# EAGLE design LAMPU_EMERGENCY_v1.0 (EAGLE 9.6.1)
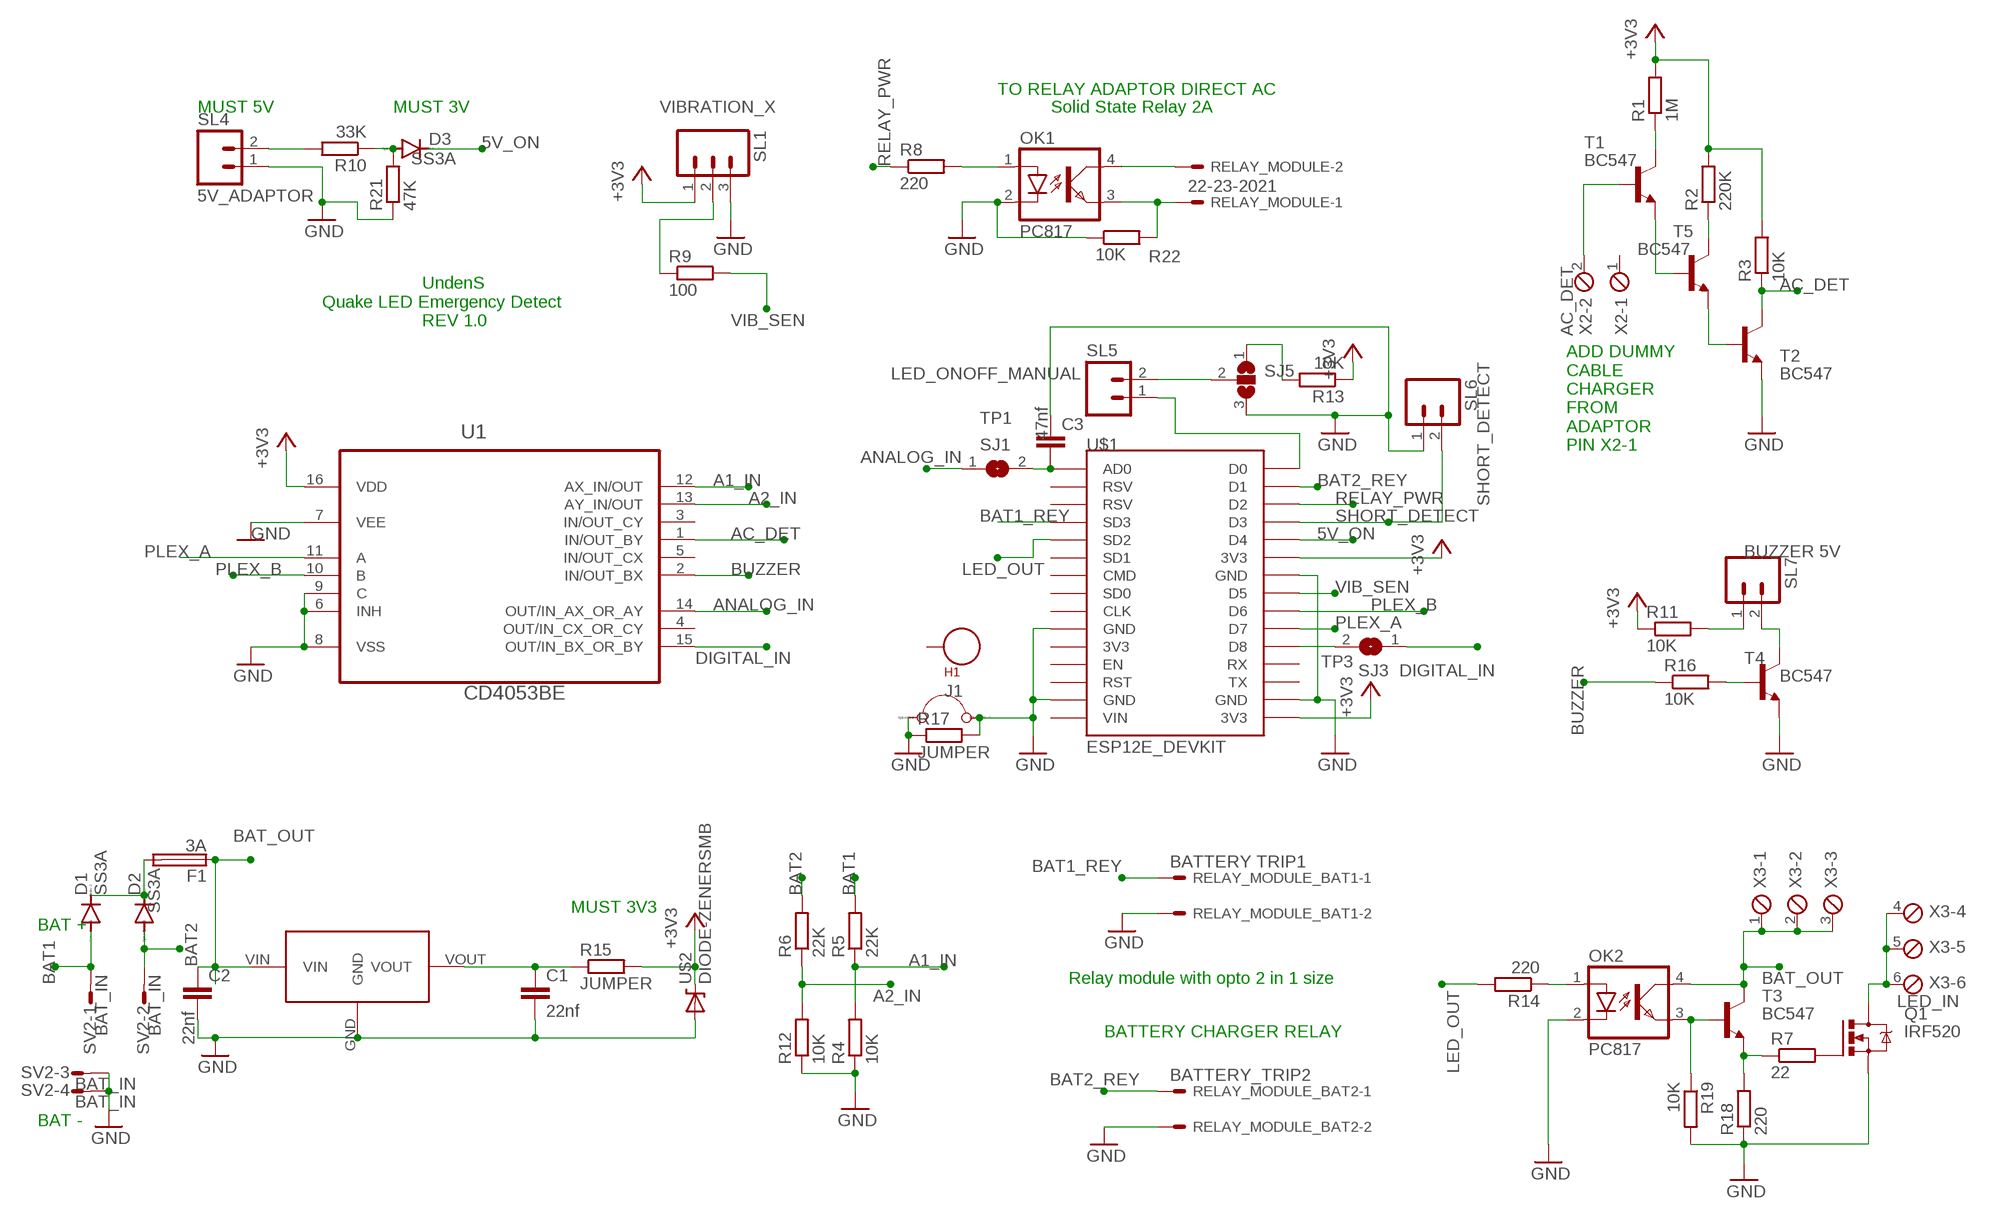
[diagram p0: schematic, sheet 1]

## Parts
C1  22nf  C-EUC0805K  [C0805K]
C2  22nf  C-EUC0805K  [C0805K]
C3  47nf  C-EUC0805K  [C0805K]
D1  SS3A  ES2D  [SMB]
D2  SS3A  ES2D  [SMB]
D3  SS3A  ES2D  [SMB]
F1  3A  FUSEGSH15  [GSH15]
H1  SEW_HOLE  [SIMPLE_HOLE]
J1  JUMPER  [05]
OK1  PC817  [DIL04]
OK2  PC817  [DIL04]
Q1  IRF520  [TO220BV]
R1  1M  R-EU_0207/7  [0207/7]
R2  220K  R-EU_0207/7  [0207/7]
R3  10K  R-EU_0207/7  [0207/7]
R4  10K  R-EU_0207/7  [0207/7]
R5  22K  R-EU_0207/7  [0207/7]
R6  22K  R-EU_0207/7  [0207/7]
R7  22  R-EU_0207/7  [0207/7]
R8  220  R-EU_0207/7  [0207/7]
R9  100  R-EU_0207/7  [0207/7]
R10  33K  R-EU_0207/7  [0207/7]
R11  10K  R-EU_0207/7  [0207/7]
R12  10K  R-EU_0207/7  [0207/7]
R13  10K  R-EU_0207/7  [0207/7]
R14  220  R-EU_0207/7  [0207/7]
R15  JUMPER  R-EU_0207/15  [0207/15]
R16  10K  R-EU_0207/7  [0207/7]
R17  JUMPER  R-EU_0207/7  [0207/7]
R18  220  R-EU_0207/7  [0207/7]
R19  10K  R-EU_0207/7  [0207/7]
R21  47K  R-EU_0207/7  [0207/7]
R22  10K  R-EU_0207/7  [0207/7]
RELAY_MODULE  22-23-2021  [22-23-2021]
RELAY_MODULE_BAT1  BATTERY TRIP1  22-23-2021  [22-23-2021]
RELAY_MODULE_BAT2  BATTERY_TRIP2  22-23-2021  [22-23-2021]
SJ1  TP1  SJW  [SJW]
SJ3  TP3  SJW  [SJW]
SJ5  SJ2WW  [SJ_2W]
SL1  VIBRATION_X  M03  [03P]
SL4  5V_ADAPTOR  M02  [02P]
SL5  LED_ONOFF_MANUAL  M02  [02P]
SL6  SHORT_DETECT  M02  [02P]
SL7  BUZZER 5V  M02  [02P]
SV2  BAT_IN  S04P  [S04P]
T1  BC547  [TO92]
T2  BC547  [TO92]
T3  BC547  [TO92]
T4  BC547  [TO92]
T5  BC547  [TO92]
U1  CD4053BE  [DIP254P762X508-16]
U$1  ESP12E_DEVKIT  [ESP12E_DEVKIT]
U$2  DIODE-ZENERSMB  [SMB-DIODE]
U$3  HT7333  [SOT89]
X2  AC_DET  MPT2  [2POL254]
X3  LED_IN  MPT6  [6POL254]

## Nets
5V_ON: D3.C U$1.D4
+3V3: R1.2 R2.2 R3.2 R11.1 R13.1 R15.2 SL1.1 U1.16(VDD) U$1.3V3@1(3V3) U$1.3V3@2(3V3) U$2.C
A1_IN: R4.2 R5.1 U1.12(AX_IN/OUT)
A2_IN: R6.1 R12.2 U1.13(AY_IN/OUT)
AC_DET: R3.1 T2.3(C) U1.1(IN/OUT_BY)
ANALOG_IN: SJ1.1 U1.14(OUT/IN_AX_OR_AY)
BAT1: D1.A R5.2 SV2.1
BAT1_REY: RELAY_MODULE_BAT1.1 U$1.SD3
BAT2: D2.A R6.2 SV2.2
BAT2_REY: RELAY_MODULE_BAT2.1 U$1.D1
BAT_OUT: C2.1 F1.1 OK2.4(COL) T3.3(C) U$3.VIN X3.1 X3.2 X3.3
BUZZER: R16.1 U1.2(IN/OUT_BX)
DIGITAL_IN: SJ3.1 U1.15(OUT/IN_BX_OR_BY)
GND: C1.2 C2.2 C3.1 J1.1(+) J1.2(-) OK1.2(C) OK2.2(C) Q1.S R4.1 R12.1 R17.1 R17.2 R18.1 R19.2 R21.1 R22.1 RELAY_MODULE_BAT1.2 RELAY_MODULE_BAT2.2 SJ5.3 SL1.3 SL4.1 SL6.1 SV2.3 SV2.4 T2.1(E) T4.1(E) U1.6(INH) U1.7(VEE) U1.8(VSS) U1.9(C) U$1.GND@0(GND) U$1.GND@1(GND) U$1.GND@2(GND) U$1.GND@3(GND) U$2.A U$3.GND
LED_OUT: R14.2 U$1.SD2
N$1: SJ3.2 U$1.D8
N$2: R1.1 T1.3(C)
N$3: T1.1(E) T5.2(B)
N$4: R2.1 T5.3(C)
N$5: T2.2(B) T5.1(E)
N$6: T1.2(B) X2.2
N$7: R13.2 SJ5.1
N$8: OK1.1(A) R8.2
N$9: OK1.4(COL) RELAY_MODULE.2
N$10: OK1.3(EMIT) R22.2 RELAY_MODULE.1
N$11: C3.2 SJ1.2 U$1.AD0
N$12: R11.2 SL7.1
N$13: R9.1 SL1.2
N$15: SL7.2 T4.3(C)
N$16: D3.A R10.1 R21.2
N$17: D1.C D2.C F1.2
N$18: R16.2 T4.2(B)
N$19: SL5.1 U$1.D0
N$20: OK2.3(EMIT) R19.1 T3.2(B)
N$21: R7.1 R18.2 T3.1(E)
N$22: Q1.G R7.2
N$23: OK2.1(A) R14.1
N$24: Q1.D X3.4 X3.5 X3.6
N$25: R10.2 SL4.2
N$26: C1.1 R15.1 U$3.VOUT
N$27: SJ5.2 SL5.2
PLEX_A: U1.11(A) U$1.D7
PLEX_B: U1.10(B) U$1.D6
RELAY_PWR: R8.1 U$1.D2
SHORT_DETECT: SL6.2 U$1.D3
VIB_SEN: R9.2 U$1.D5
Unconnected: H1.P$1 U1.3(IN/OUT_CY) U1.4(OUT/IN_CX_OR_CY) U1.5(IN/OUT_CX) U$1.3V3@0(3V3) U$1.CLK U$1.CMD U$1.EN U$1.RST U$1.RSV@0(RSV) U$1.RSV@1(RSV) U$1.RX U$1.SD0 U$1.SD1 U$1.TX U$1.VIN X2.1

## Notes on the sheet
- TO RELAY ADAPTOR DIRECT AC
- MUST 5V | MUST 3V | Solid State Relay 2A
- UndenS
  Quake LED Emergency Detect
                      REV 1.0
- ADD DUMMY
  CABLE
  CHARGER
  FROM
  ADAPTOR
  PIN X2-1
- MUST 3V3
- BAT +
- Relay module with opto 2 in 1 size
- BATTERY CHARGER RELAY
- BAT -

## Library data of the parts
C1-C3 = rcl:C-EU: CAPACITOR, European symbol; SPICEPREFIX: C
D1-D3 = diode:ES2D: DIODE super fast rectifier, 2 A
F1 = fuse:FUSE: Fuse; OC_FARNELL: unknown; OC_NEWARK: unknown
H1 = LilyPad-Wearables:SEW_HOLE: Simple sew-hole .1" diameter hole with 20mil annular ring
J1 = Misc:JUMPER: A wire jumper. This component lets you give the same net two different names
OK1 = optocoupler:PC817: SHARP OPTO COUPLER; MPN: PC817X4J000F; OC_FARNELL: 9707727; OC_NEWARK: 97K7059
OK2 = optocoupler:PC817: SHARP OPTO COUPLER; MPN: PC817X4J000F; OC_FARNELL: 9707727; OC_NEWARK: 97K7059; SPICEPREFIX: O
Q1 = transistor-power:IRF520: HEXFET Power MOSFET; SPICEPREFIX: Q
R1-R14 R16-R19 R21 R22 = rcl:R-EU_: RESISTOR, European symbol; SPICEPREFIX: R
R15 = resistor:R-EU_: RESISTOR, European symbol
RELAY_MODULE RELAY_MODULE_BAT1 RELAY_MODULE_BAT2 = con-molex:22-23-2021: .100" (2.54mm) Center Header - 2 Pin; MF: MOLEX; MPN: 22-23-2021; OC_FARNELL: 1462926; OC_NEWARK: 25C3832
SJ1 SJ3 = jumper:SJ: SMD solder JUMPER
SJ5 = jumper:SJ2W: SMD solder JUMPER
SL1 = con-amp-quick:M03: AMP QUICK CONNECTOR; OC_FARNELL: unknown; OC_NEWARK: unknown
SL4-SL7 = con-amp-quick:M02: AMP QUICK CONNECTOR; OC_FARNELL: unknown; OC_NEWARK: unknown
SV2 = con-amp-mt:S04P: AMP MT CONNECTOR; OC_FARNELL: unknown; OC_NEWARK: unknown
T1 T2 T5 = transistor:BC547: NPN TRANSISTOR
T3 T4 = transistor:BC547: NPN TRANSISTOR; SPICEPREFIX: J
U1 = Texas Instruments_By_element14_Batch_1:CD4053BE: The CD4053B is a triple 2-Channel multiplexer having three separate digital control inputs.; MPN: CD4053BE; OC_FARNELL: 1106110; OC_NEWARK: 60K5121; PACKAGE: PDIP-16; SUPPLIER: Texas Instruments
U$1 = ESP12E_DEVKIT:ESP12E_DEVKIT: ESP12E DEVKIT BOARD
U$2 = SparkFun-DiscreteSemi:DIODE-ZENER: Zener Diode Production Part - 8199 3.4V Zener Voltage
U$3 = HT7333_SOT89:HT7333
X2 = con-phoenix-254:MPT2: PHOENIX CONNECTOR; OC_FARNELL: unknown; OC_NEWARK: unknown
X3 = con-phoenix-254:MPT6: PHOENIX CONNECTOR; OC_FARNELL: unknown; OC_NEWARK: unknown; SPICEPREFIX: X

## Board
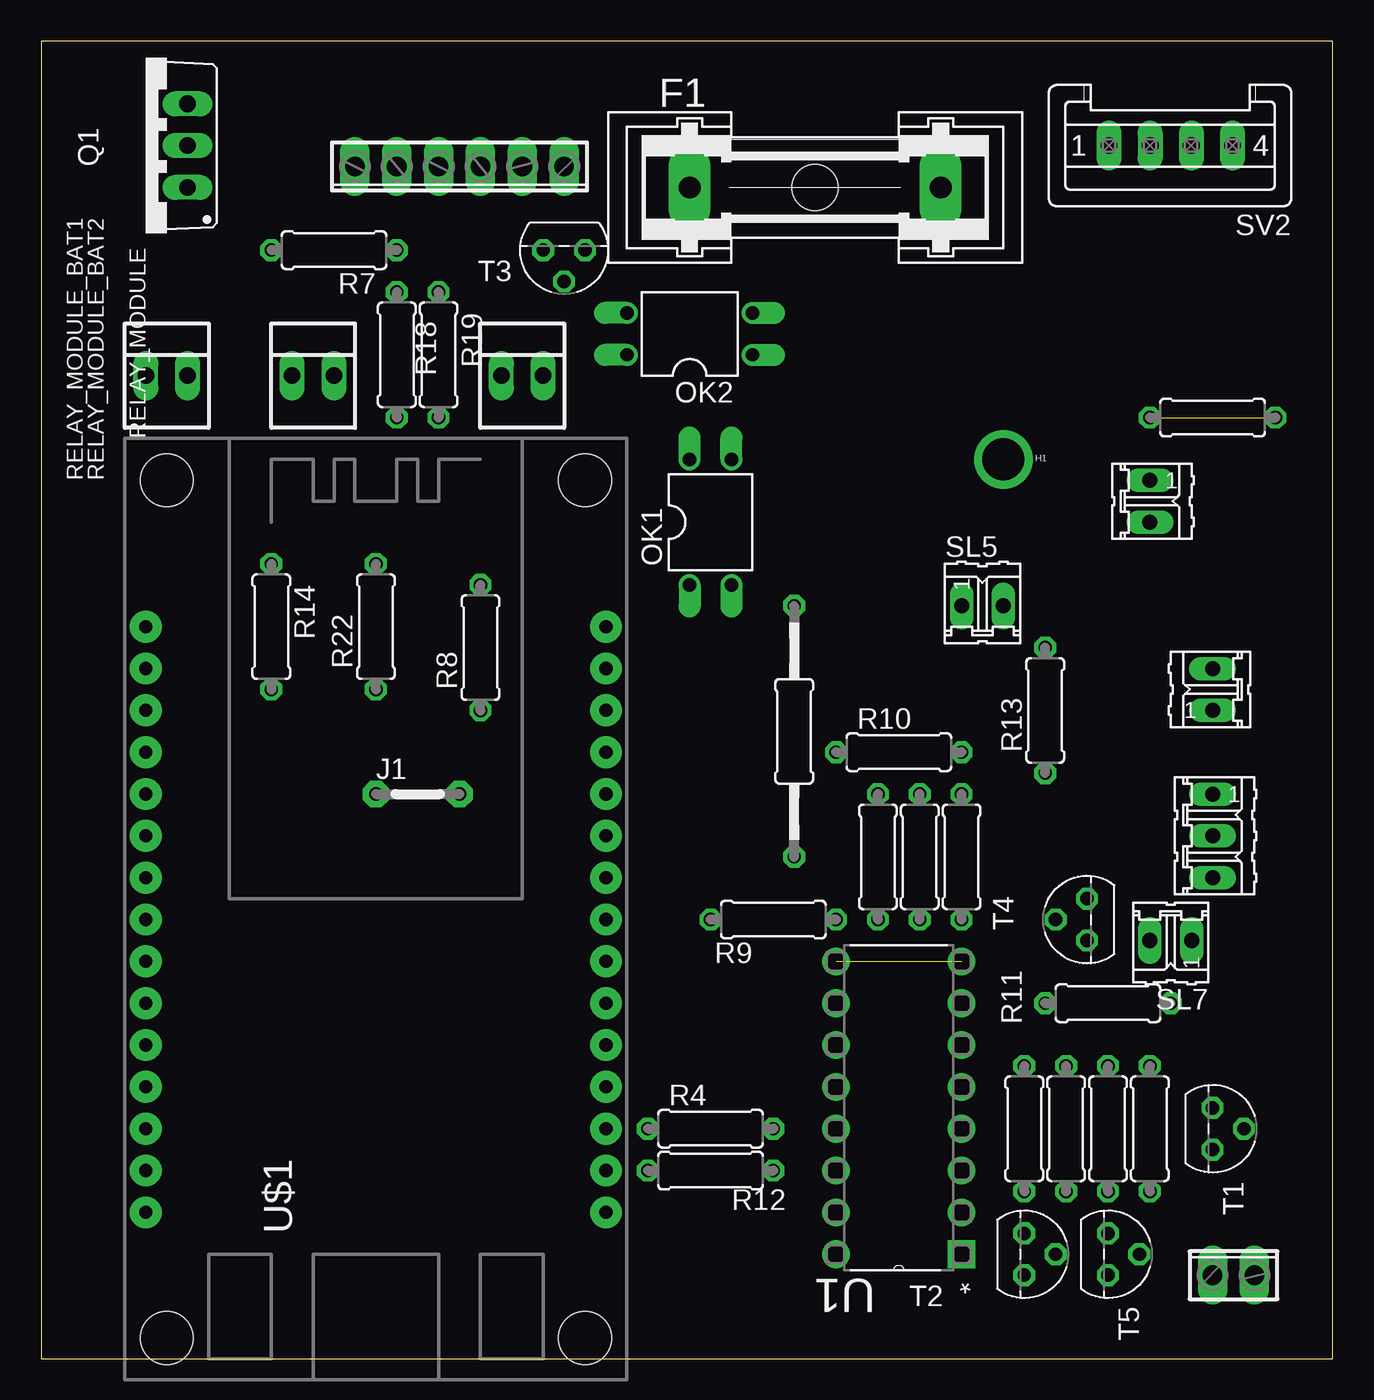
[diagram p1: board, top side]
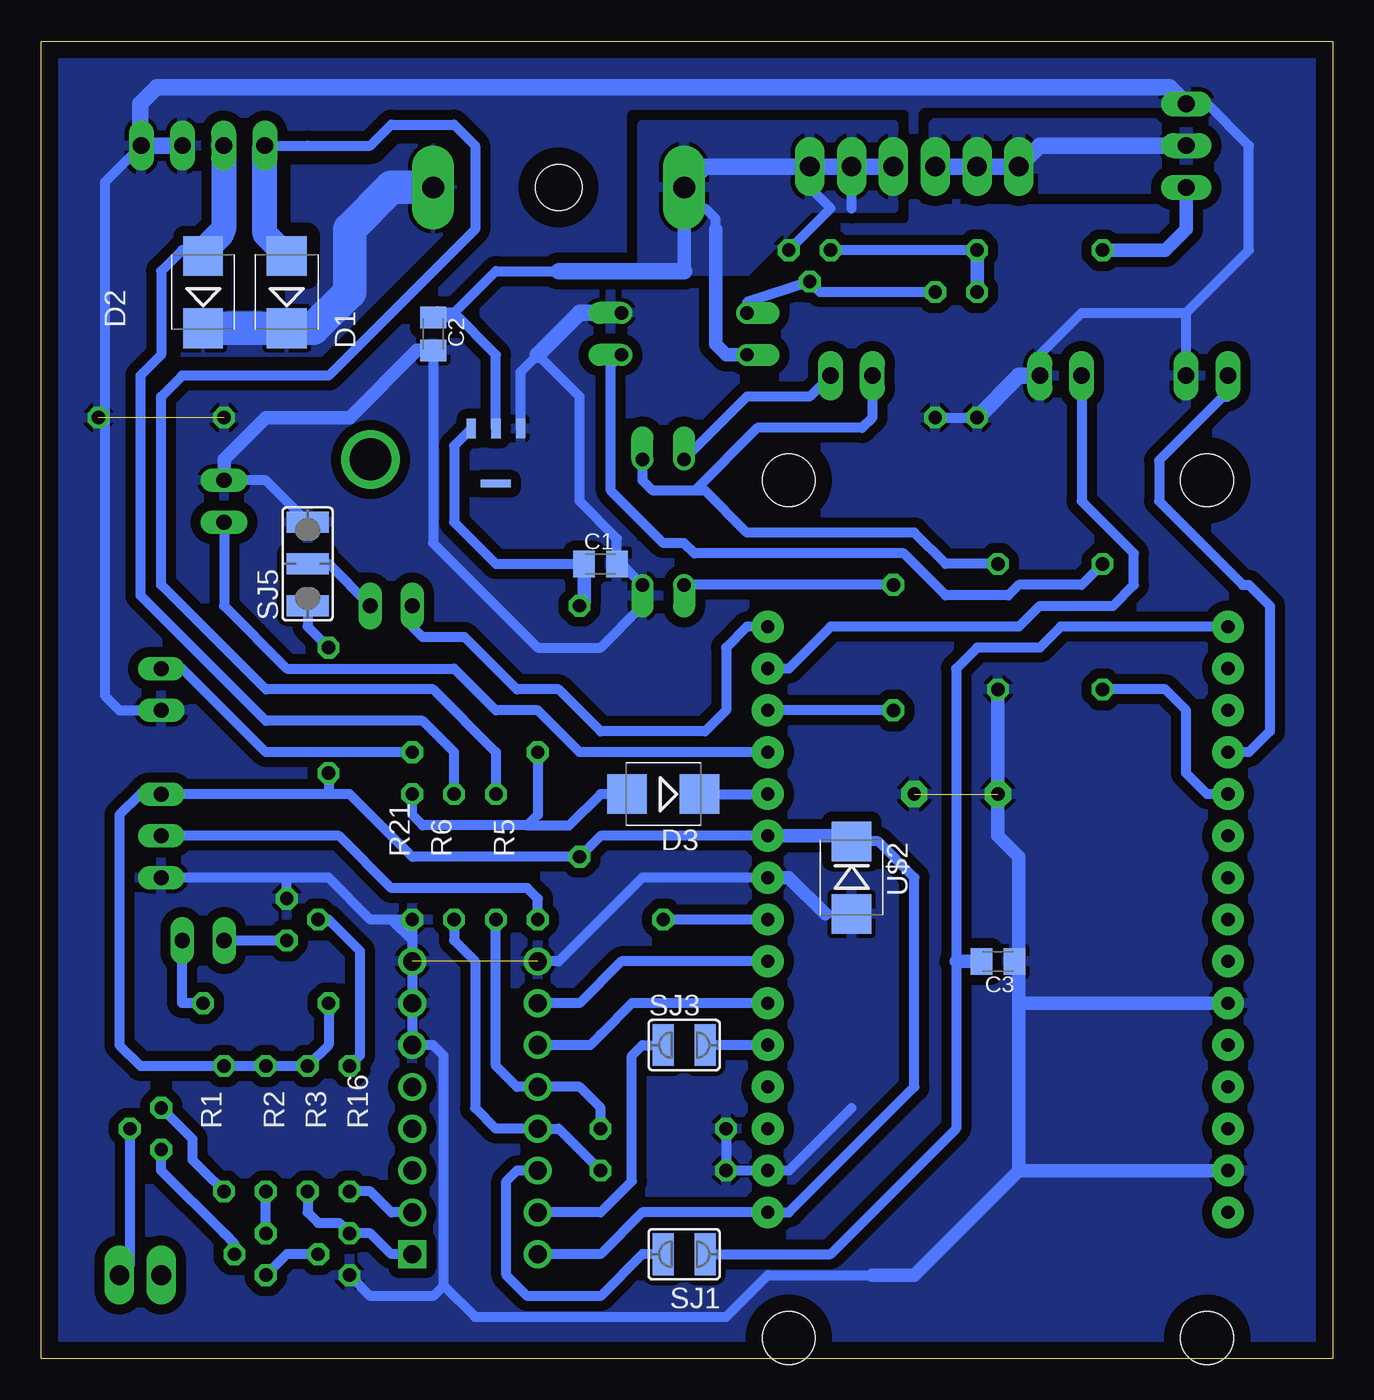
[diagram p2: board, bottom side, seen from below]

Size 78.41 x 80 mm. Coordinates in mm from the lower left corner, seen from the top.
Outline: 0,0 78.41,0 78.41,80 0,80 0,0
Copper layers (1*16): Top 0.035mm / dielectric 1.5mm / Bottom 0.035mm
Design rules "default": minimum track width 6mil, minimum drill 0.35mm, track to track 6mil, track to pad 6mil, pad to pad 6mil, via to via 6mil, smd to smd 6mil, copper to edge 40mil, drill to drill 6mil, minimum pad ring 10mil, minimum via ring 8mil, stop-mask expansion 4mil, vias tented up to drill 0mil, thermal gap 10mil

### Footprints (pad centres in the part's own frame; a part is rotated, then mirrored left to right if it is on the bottom)
C0805K = smd 1.3 x 1.6: 1 -1,0; 2 1,0
SMB = smd 2.4 x 2.4: A 2.2,0; C -2.2,0
GSH15 = drill 1.321 pad 2.54 long: 1 -7.62,0; 2 7.62,0 | hole 2.794: 0,0
SIMPLE_HOLE = drill 2.54 pad 3.048: P$1 0,0
05 = drill 0.813 pad 1.6 octagon: 1 -2.54,0; 2 2.54,0
DIL04 = drill 0.813 offset: 1 -1.27,-3.81; 2 1.27,-3.81; 3 1.27,3.81; 4 -1.27,3.81
TO220BV = drill 1.016 long: D 0,-2.54; G -2.54,-2.54; S 2.54,-2.54
0207/7 = drill 0.813 octagon: 1 -3.81,0; 2 3.81,0
0207/15 = drill 0.813 octagon: 1 -7.62,0; 2 7.62,0
22-23-2021 = drill 1 long: 1 -1.27,0; 2 1.27,0
SJW = smd 1.27 x 2.54: 1 -1.27,0; 2 1.27,0
SJ_2W = smd 1.27 x 2.54: 1 -2.54,0; 2 0,0; 3 2.54,0
03P = drill 0.914 long: 1 -2.54,0; 2 0,0; 3 2.54,0
02P = drill 0.914 long: 1 -1.27,0; 2 1.27,0
S04P = drill 1.016 long: 1 3.75,0; 2 1.25,0; 3 -1.25,0; 4 -3.75,0
TO92 = drill 0.813 octagon: 1 1.27,0; 2 0,1.905; 3 -1.27,0
DIP254P762X508-16 = drill 1.118 square: 1 -7.62,17.78 | drill 1.118: 2 -7.62,15.24; 3 -7.62,12.7; 4 -7.62,10.16; 5 -7.62,7.62; 6 -7.62,5.08; 7 -7.62,2.54; 8 -7.62,0; 9 0,0; 10 0,2.54; 11 0,5.08; 12 0,7.62; 13 0,10.16; 14 0,12.7; 15 0,15.24; 16 0,17.78
ESP12E_DEVKIT = drill 0.8 pad 1.93: 3V3@0 -11.43,-7.62; 3V3@1 16.51,5.08; 3V3@2 16.51,-17.78; AD0 -11.43,17.78; CLK -11.43,-2.54; CMD -11.43,2.54; D0 16.51,17.78; D1 16.51,15.24; D2 16.51,12.7; D3 16.51,10.16; D4 16.51,7.62; D5 16.51,0; D6 16.51,-2.54; D7 16.51,-5.08; D8 16.51,-7.62; EN -11.43,-10.16; GND@0 -11.43,-5.08; GND@1 -11.43,-15.24; GND@2 16.51,2.54; GND@3 16.51,-15.24; RST -11.43,-12.7; RSV@0 -11.43,15.24; RSV@1 -11.43,12.7; RX 16.51,-10.16; SD0 -11.43,0; SD1 -11.43,5.08; SD2 -11.43,7.62; SD3 -11.43,10.16; TX 16.51,-12.7; VIN -11.43,-17.78 | hole 3.2: -10.16,26.67; 15.24,26.67; 15.24,-25.4; -10.16,-25.4
SMB-DIODE = smd 2.4 x 2.4: A 2.2,0; C -2.2,0
SOT89 = smd 0.559 x 1.194: GND -1.499,-0.597; VIN 0,-0.597; VOUT 1.499,-0.597 | smd 1.829 x 0.457: P$4 0,2.743
2POL254 = drill 1.2 long: 1 -1.27,0; 2 1.27,0
6POL254 = drill 1.2 pad 1.778 long: 1 -6.35,0; 2 -3.81,0; 3 -1.27,0; 4 1.27,0; 5 3.81,0; 6 6.35,0

### Placement (x,y rotation side)
C1  44.45,48.26 0 bottom
C2  54.61,62.23 270 bottom
C3  20.32,24.13 180 bottom
D1  63.5,64.77 90 bottom
D2  68.58,64.77 90 bottom
D3  40.64,34.29 180 bottom
F1  46.99,71.12 0 top
H1  58.42,54.61 0 top
J1  22.86,34.29 0 top
OK1  40.64,50.8 0 top
OK2  39.37,62.23 90 top
Q1  6.35,73.66 90 top
R1  67.31,13.97 90 top
R2  64.77,13.97 90 top
R3  62.23,13.97 90 top
R4  40.64,13.97 0 top
R5  50.8,30.48 90 top
R6  53.34,30.48 90 top
R7  17.78,67.31 180 top
R8  26.67,43.18 90 top
R9  44.45,26.67 180 top
R10  52.07,36.83 0 top
R11  64.77,21.59 0 top
R12  40.64,11.43 0 top
R13  60.96,39.37 90 top
R14  13.97,44.45 270 top
R15  45.72,38.1 270 top
R16  59.69,13.97 90 top
R17  71.12,57.15 0 top
R18  21.59,60.96 90 top
R19  24.13,60.96 270 top
R21  55.88,30.48 90 top
R22  20.32,44.45 90 top
RELAY_MODULE  29.21,59.69 0 top
RELAY_MODULE_BAT1  7.62,59.69 0 top
RELAY_MODULE_BAT2  16.51,59.69 0 top
SJ1  39.37,6.35 0 bottom
SJ3  39.37,19.05 0 bottom
SJ5  62.23,48.26 90 bottom
SL1  71.12,31.75 270 top
SL4  71.12,40.64 90 top
SL5  57.15,45.72 0 top
SL6  67.31,52.07 270 top
SL7  68.58,25.4 180 top
SV2  68.58,73.66 180 top
T1  71.12,13.97 270 top
T2  59.69,6.35 270 top
T3  31.75,67.31 180 top
T4  63.5,26.67 90 top
T5  64.77,6.35 270 top
U1  48.26,24.13 180 top
U$1  17.78,26.67 0 top
U$2  29.21,29.21 270 bottom
U$3  50.8,55.88 180 bottom
X2  72.39,5.08 0 top
X3  25.4,72.39 180 top

### Tracks (layer width: path | path; a pad name or v marks a point on that pad's centre or on a via)
5V_ON
  Bottom 0.61: D3.C U$1.D4
+3V3
  Bottom 0.61: SL1.1 72.39,34.29 73.66,33.02 73.66,19.05 72.39,17.78 R1.2 R2.2 R3.2 60.96,19.05 R11.1 | 69.85,34.29 SL1.1 | U$1.3V3@1 44.45,31.75 R15.2 55.88,30.48 59.69,34.29 60.96,34.29 | U1.16 44.45,6.35 41.91,8.89 U$1.3V3@2 33.02,8.89 25.4,16.51 25.4,29.21 27.6,31.41 U$2.C | R13.1 60.96,34.29 | 60.96,34.29 SL1.1
  Bottom 0.813: U$2.C 29.55,31.75 U$1.3V3@1
A1_IN
  Bottom 0.61: R4.2 44.45,15.24 45.72,16.51 U1.12 49.53,16.51 50.8,17.78 R5.1
A2_IN
  Bottom 0.61: R12.2 46.99,13.97 U1.13 50.8,13.97 52.07,15.24 52.07,24.13 53.34,25.4 R6.1
AC_DET
  Bottom 0.61: U1.1 57.15,6.35 58.42,7.62 T2.3 60.33,8.26 61.59,8.26 62.23,8.89 R3.1
ANALOG_IN
  Bottom 0.61: U1.14 49.53,11.43 50.17,10.79 50.17,5.08 48.9,3.81 44.45,3.81 41.91,6.35 SJ1.1
BAT1
  Bottom 0.61: 62.23,73.66 SV2.1 58.42,73.66 57.15,74.93 53.34,74.93 52.07,73.66 52.07,68.58 60.96,59.69 69.85,59.69 71.12,58.42 71.12,46.99 64.77,40.64 54.61,40.64 50.8,36.83 R5.2
  Bottom 1.524: D1.A 64.83,68.3 SV2.1
BAT1_REY
  Bottom 0.61: RELAY_MODULE_BAT1.1 6.35,58.42 6.67,58.42 10.54,54.55 10.54,52.07 5.46,46.99 5.08,46.99 3.81,45.72 3.81,38.1 5.08,36.83 U$1.SD3
BAT2
  Bottom 0.61: D2.A 68.92,67.31 69.85,67.31 71.12,66.04 71.12,60.96 72.39,59.69 72.39,46.35 64.77,38.73 55.25,38.73 53.34,36.83 R6.2
  Bottom 1.016: 67.33,68.22 67.33,68.58
  Bottom 1.27: 67.33,68.22 D2.A
  Bottom 1.524: SV2.2 67.33,68.58 68.58,67.33 D2.A
BAT2_REY
  Bottom 0.61: U$1.D1 33.02,41.91 30.48,44.45 19.05,44.45 17.78,45.72 13.34,45.72 12.07,46.99 12.07,48.89 15.24,52.07 RELAY_MODULE_BAT2.1
BAT_OUT
  Bottom 0.61: 37.47,68.58 37.47,69.22 38.1,69.85 39.37,69.85 | 29.21,69.85 X3.2 | T3.3 30.48,69.85 31.75,71.12 X3.1 | U$3.VIN 50.8,60.96 53.34,63.5 54.34,63.5 | C2.1 53.61,63.23 50.8,66.04 45.72,66.04
  Bottom 0.813: OK2.4 36.83,60.96 37.47,61.59 37.47,68.58 | 39.37,66.04 39.37,69.85 F1.1 | 54.34,63.5 C2.1
  Bottom 1.016: X3.3 X3.2 | X3.2 X3.1 38.1,72.39 F1.1 | X3.2 29.21,71.12 | 39.37,66.04 45.72,66.04 46.99,66.04
  pour Bottom: 26.67,74.93 26.67,69.85 31.75,69.85 35.56,66.04 41.91,66.04 41.91,74.93
BUZZER
  Bottom 0.61: U1.2 57.15,8.89 58.42,10.16 R16.1
DIGITAL_IN
  Bottom 0.61: U1.15 44.45,8.89 42.55,10.79 42.55,18.41 41.91,19.05 SJ3.1
GND  (3 unrouted)
  Bottom 0.61: U1.8 U1.7 U1.6 54.61,19.05 53.98,18.41 53.98,4.45 | R4.1 R12.1 U$1.GND@3 33.02,11.43 29.21,15.24 | U1.9 46.99,24.13 41.91,29.21 U$1.GND@2 | 57.15,26.67 55.88,25.4 U1.8 | 57.15,26.67 58.42,26.67 60.96,29.21 63.5,29.21 | SV2.4 74.55,71.44 74.55,40.26 73.66,39.37 SL4.1 | U1.8 R21.1 57.15,26.67 | 63.5,29.21 SL1.3 | T4.1 63.5,29.21 | T2.1 58.42,3.81 54.61,3.81 53.98,4.45 | 53.98,4.45 52.07,2.54 36.83,2.54 34.29,5.08 27.94,5.08 26.67,5.08 | RELAY_MODULE_BAT1.2 8.89,63.5 | Q1.S 7.62,76.2 5.08,73.66 5.08,67.31 8.89,63.5 | RELAY_MODULE_BAT2.2 17.78,60.96 15.24,63.5 8.89,63.5 | SJ5.3 64.77,53.34 SL6.1 | J1.1 20.32,39.37 | U$3.GND 49.3,59.92 48.26,60.96 45.72,58.42 45.72,52.07 43.45,49.8 C1.2 43.18,48.26 OK1.2 41.91,45.72 44.45,43.18 48.26,43.18 54.61,49.53 C2.2 | R19.2 R18.1
  Bottom 0.813: R22.1 20.32,39.37 20.32,31.75 19.05,30.48 19.05,24.4 C3.1 19.05,23.86 19.05,21.59 | 54.34,60.96 C2.2 55.61,61.23 59.69,57.15 64.77,57.15 67.31,54.61 SL6.1 | U$1.GND@0 19.05,21.59 | U$1.GND@1 19.05,11.43 | 19.05,21.59 19.05,11.43 | 19.05,11.43 25.4,5.08 27.94,5.08 | 30.82,27.01 33.02,29.21 U$1.GND@2
  Bottom 1.016: Q1.S 9.9,77.21 71.38,77.21 72.39,76.2 72.39,73.66 SV2.4 SV2.3 | R18.1 19.05,59.69 RELAY_MODULE_BAT2.2 | OK2.2 45.72,63.5 48.26,60.96
  pour Bottom (isolate 0.61, rank 6): -2.54,85.09 -2.54,-3.81 -1.27,-5.08 80.01,-5.08 80.01,83.82 -1.27,83.82
LED_OUT
  Bottom 0.61: U$1.SD2 7.62,34.29 8.89,35.56 8.89,39.37 10.16,40.64 R14.2
N$1
  Bottom 0.61: U$1.D8 SJ3.2
N$2
  Bottom 0.61: R1.1 68.58,11.43 69.22,12.07 69.22,13.34 T1.3
N$3
  Bottom 0.61: T1.1 71.12,11.43 67.31,7.62 66.68,6.99 T5.2
N$4
  Bottom 0.61: T5.3 R2.1
N$5
  Bottom 0.61: T5.1 63.5,6.35 T2.2
N$6
  Bottom 0.61: X2.2 73.03,5.71 T1.2
N$7
  Bottom 0.61: SJ5.1 62.23,44.45 R13.2
N$8
  Bottom 0.61: 39.37,45.72 OK1.1 R8.2
N$9
  Bottom 0.61: RELAY_MODULE.2 31.75,58.42 35.56,58.42 OK1.4
N$10
  Bottom 0.61: RELAY_MODULE.1 27.94,57.15 28.57,56.51 34.92,56.51 38.73,52.7 | OK1.3 41.91,53.34 41.28,52.7 38.73,52.7 | 38.73,52.7 38.1,52.7 35.56,50.16 25.4,50.16 23.5,48.26 R22.2
N$11
  Bottom 0.61: SJ1.2 30.48,6.35 22.86,13.97 22.86,24.13 22.86,41.91 21.59,43.18 17.78,43.18 16.51,44.45 U$1.AD0
  Bottom 0.813: C3.2 22.86,24.13
N$12
  Bottom 0.61: R11.2 69.85,21.59 SL7.1
N$13
  Bottom 0.61: R9.1 48.26,27.94 48.9,28.57 57.15,28.57 60.33,31.75 SL1.2
N$15
  Bottom 0.61: SL7.2 T4.3
N$16
  Bottom 0.61: R21.2 55.88,33.02 55.25,32.38 48.9,32.38 | 48.9,32.38 48.26,33.02 R10.1 | 48.9,32.38 46.36,32.38 44.45,34.29 D3.A
N$17
  Bottom 1.27: D2.C 68.58,62.23 68.24,62.57 D1.C 61.89,62.57
  Bottom 2.032: F1.2 57.15,71.12 59.69,68.58 59.69,64.77 61.89,62.57 68.24,62.57
  pour Bottom (isolate 0.813): 52.07,73.66 53.34,74.93 57.15,74.93 58.42,73.66 63.5,73.66 63.5,63.5 68.58,63.5 69.85,62.23 69.85,59.69 60.96,59.69 52.07,68.58
N$18
  Bottom 0.61: T4.2 60.96,26.67 59.06,24.77 59.06,18.41 R16.2
N$19
  Bottom 0.61: U$1.D0 35.56,44.45 36.83,43.18 36.83,39.37 38.1,38.1 44.45,38.1 46.99,40.64 49.53,40.64 52.7,43.81 55.25,43.81 55.88,44.45 SL5.1
N$20
  Bottom 0.61: OK2.3 35.56,64.14 T3.2 31.11,64.77 R19.1
  Bottom 0.813: 34.29,63.5 OK2.3
N$21
  Bottom 0.61: R7.1 T3.1
  Bottom 0.813: R18.2 R7.1
N$22
  Bottom 0.813: Q1.G 8.89,68.58 10.16,67.31 R7.2
N$23
  Bottom 0.61: OK2.1 43.81,60.32 43.81,52.7 40.64,49.53 39.37,49.53 38.73,48.89 26.04,48.89 23.5,46.35 19.68,46.35 19.05,46.99 15.24,46.99 R14.1
N$24
  Bottom 1.016: X3.4 X3.5 X3.6 17.78,73.66 Q1.D
  pour Bottom (isolate 0.61): 8.89,74.93 8.89,72.39 10.16,71.12 24.13,71.12 24.13,74.93
N$25
  Bottom 0.61: SL4.2 69.85,41.91 64.77,36.83 R10.2
N$26
  Bottom 0.61: U$3.VOUT 53.34,55.44 53.34,50.8 50.8,48.26 C1.1
  Bottom 0.813: C1.1 45.45,45.99 R15.1
N$27
  Bottom 0.61: SJ5.2 60.96,48.26 SL5.2
PLEX_A
  Bottom 0.61: 46.99,19.05 U1.11 45.09,19.05 44.45,19.68 42.55,21.59 U$1.D7
PLEX_B
  Bottom 0.61: U1.10 45.72,21.59 43.18,24.13 U$1.D6
RELAY_PWR
  Bottom 0.61: R8.1 U$1.D2
SHORT_DETECT
  Bottom 0.61: SL6.2 67.31,45.72 63.5,41.91 53.34,41.91 50.8,39.37 48.26,39.37 45.72,36.83 U$1.D3
VIB_SEN
  Bottom 0.61: U$1.D5 R9.2